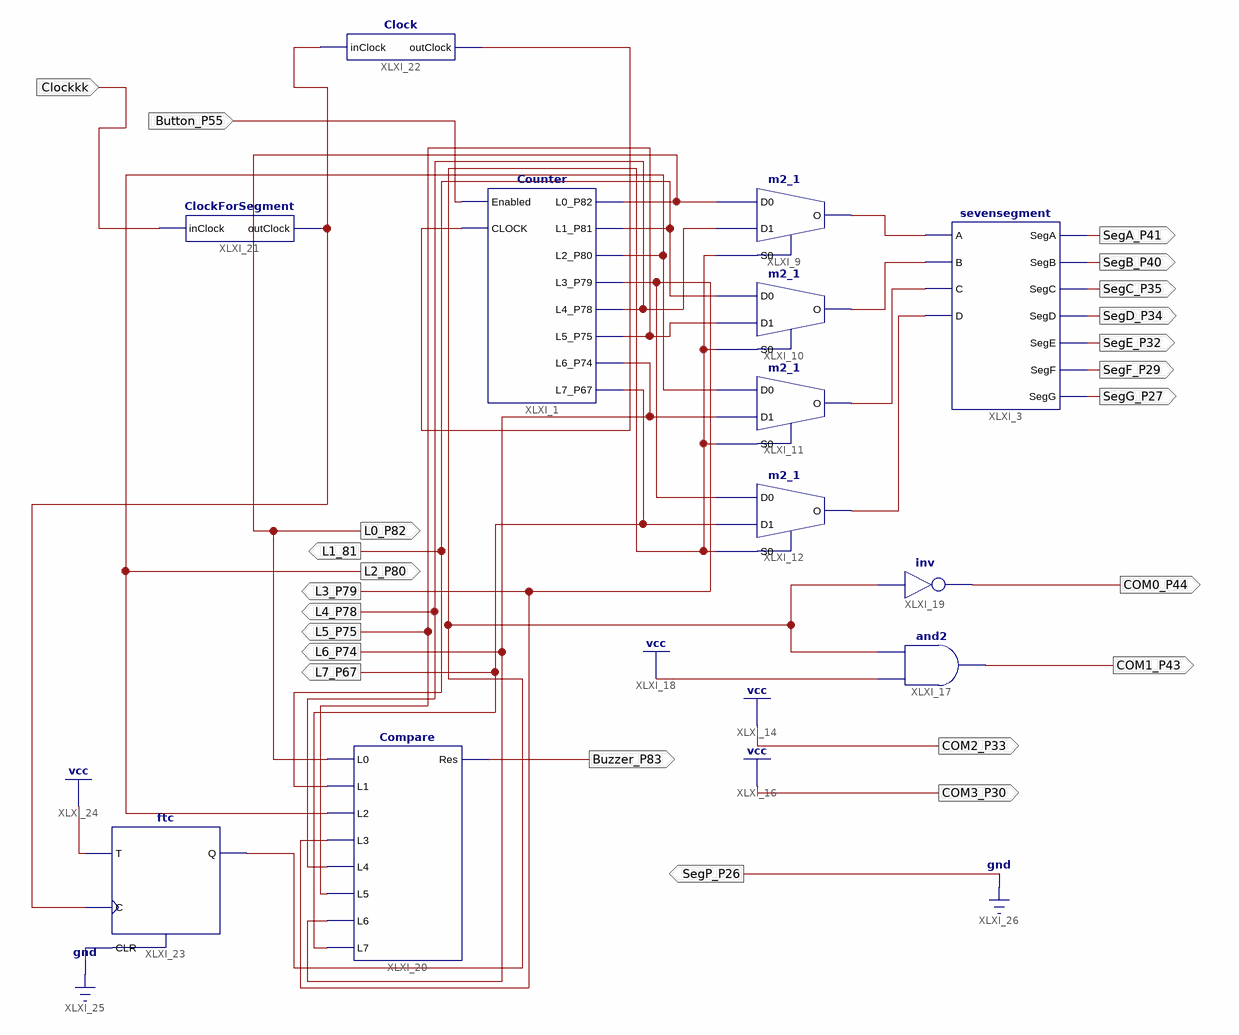
[diagram p0: schematic sheet 1]
// Xilinx ISE schematic result.sch (spartan6) as structural Verilog: 12 symbols, 23 ports
module result (
  input  Button_P55,
  input  Clockkk,
  output L5_P75,
  output COM2_P33,
  output COM3_P30,
  output COM1_P43,
  output SegA_P41,
  output SegB_P40,
  output SegC_P35,
  output SegD_P34,
  output SegE_P32,
  output SegF_P29,
  output SegG_P27,
  output L0_P82,
  output L1_81,
  output L3_P79,
  output L4_P78,
  output L6_P74,
  output L7_P67,
  output COM0_P44,
  output Buzzer_P83,
  output L2_P80,
  output SegP_P26
);

  wire Kuay, XLXN_19, XLXN_29, XLXN_30, XLXN_33, XLXN_34, XLXN_115;

  Counter XLXI_1 (
    .CLOCK(XLXN_19), .Enabled(Button_P55), .L0_P82(L0_P82), .L1_P81(L1_81), .L2_P80(L2_P80), .L3_P79(L3_P79),
    .L4_P78(L4_P78), .L5_P75(L5_P75), .L6_P74(L6_P74), .L7_P67(L7_P67));
  m2_1 XLXI_10 (.D0(L1_81), .D1(L5_P75), .S0(Kuay), .O(XLXN_30));
  m2_1 XLXI_11 (.D0(L2_P80), .D1(L6_P74), .S0(Kuay), .O(XLXN_33));
  m2_1 XLXI_9 (.D0(L0_P82), .D1(L4_P78), .S0(Kuay), .O(XLXN_29));
  m2_1 XLXI_12 (.D0(L3_P79), .D1(L7_P67), .S0(Kuay), .O(XLXN_34));
  sevensegment XLXI_3 (
    .A(XLXN_29), .B(XLXN_30), .C(XLXN_33), .D(XLXN_34), .SegA(SegA_P41), .SegB(SegB_P40), .SegC(SegC_P35),
    .SegD(SegD_P34), .SegE(SegE_P32), .SegF(SegF_P29), .SegG(SegG_P27));
  and XLXI_17 (COM1_P43, 1'b1, Kuay);
  not XLXI_19 (COM0_P44, Kuay);
  Compare XLXI_20 (
    .L0(L0_P82), .L1(L1_81), .L2(L2_P80), .L3(L3_P79), .L4(L4_P78), .L5(L5_P75), .L6(L6_P74), .L7(L7_P67),
    .Res(Buzzer_P83));
  ClockForSegment XLXI_21 (.inClock(Clockkk), .outClock(XLXN_115));
  Clock XLXI_22 (.inClock(XLXN_115), .outClock(XLXN_19));
  ftc XLXI_23 (.C(XLXN_115), .CLR(1'b0), .T(1'b1), .Q(Kuay));

  assign COM2_P33 = 1'b1;
  assign COM3_P30 = 1'b1;
  assign SegP_P26 = 1'b0;
endmodule
